# EasyEDA Pro project Version2.eprj

# Schematic Design

## Sheets
1 inputs: Board Name: v2.0; Create Date: 2025-04-06; Page Name: inputs; Project Name: KVM Assistant 3; Schematic Name: Design; Update Date: 2025-04-19; Company: EasyEDA.com; Page Size: A4; Version: V1.0
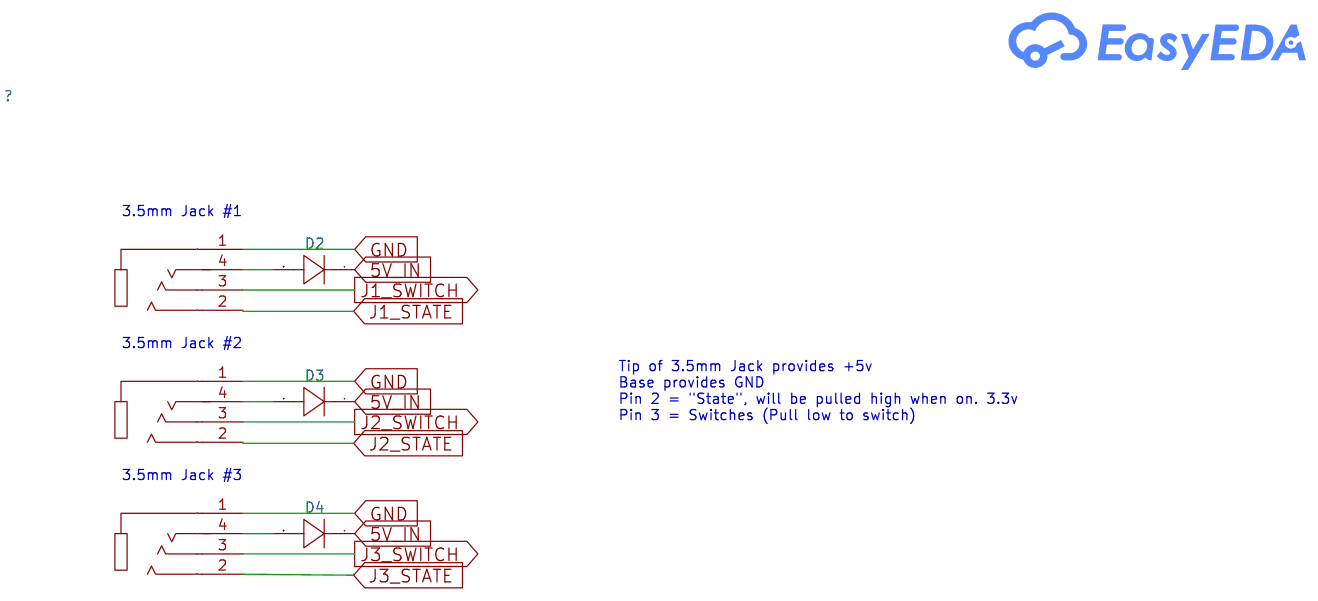
[diagram p0: inputs]
2 logic: Page Name: logic
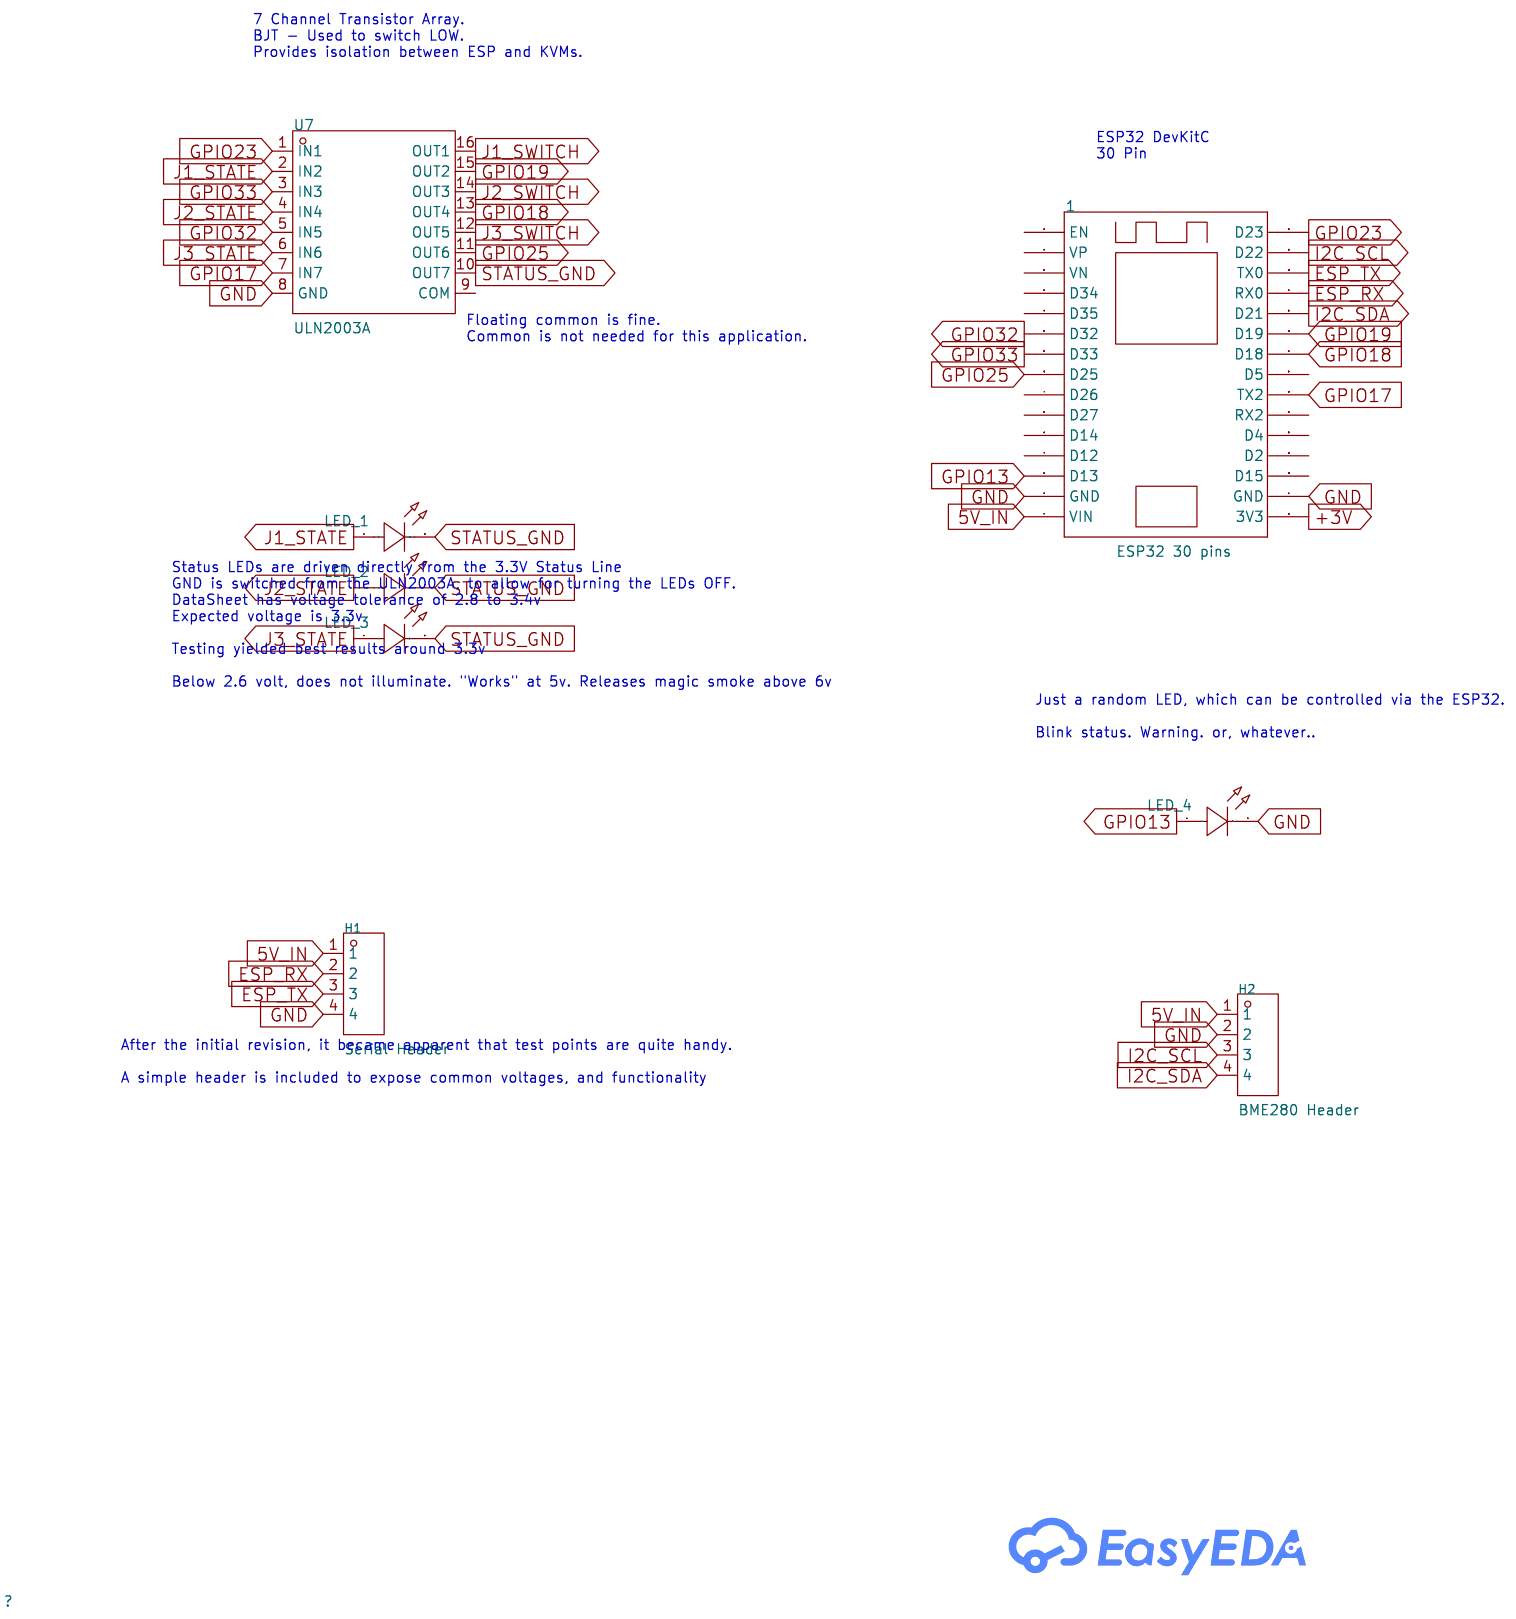
[diagram p1: logic]

## Parts
sheet inputs
3.5mm1  PJ-320D  [AUDIO-SMD_PJ-320D]
3.5mm2  PJ-320D  [AUDIO-SMD_PJ-320D]
3.5mm3  PJ-320D  [AUDIO-SMD_PJ-320D]
D2  -  [DO-41_BD2.4-L4.7-P8.70-D0.9-RD]
D3  -  [DO-41_BD2.4-L4.7-P8.70-D0.9-RD]
D4  -  [DO-41_BD2.4-L4.7-P8.70-D0.9-RD]
sheet logic
1  ESP32 30 pins  [ESP32 DEVKIT 30 PINS]
H1  Serial Header  [HDR-TH_4P-P2.54-V-M]
H2  BME280 Header  [HDR-TH_4P-P2.54-V-M]
LED_1  DY-332SUGD-A3  [LED-TH_BD5.9-P2.54-FD]
LED_2  DY-332SUGD-A3  [LED-TH_BD5.9-P2.54-FD]
LED_3  DY-332SUGD-A3  [LED-TH_BD5.9-P2.54-FD]
LED_4  DY-332SUGD-A3  [LED-TH_BD5.9-P2.54-FD]
U7  ULN2003A  [DIP-16_L20.0-W6.4-P2.54-LS7.6-BL]

## Library data of the parts
3.5mm1-3.5mm3 = PJ-320D_C431535: Connector Type:3.5mm Headphone Jack Current Rating (Max):500mA Voltage Rating (Max):50V Contact Material:Copper Contact Plating:Silver Operating Temperature Range:-30℃~+70℃ Operating Temperature Range:-30℃~+70℃; LCSC Part Name: 3.5mm耳机座; Supplier Part: C431535; Manufacturer: SHOU HAN(首韩); Supplier Footprint: SMD; JLCPCB Part Class: Extended Part; Datasheet: https://atta.szlcsc.com/upload/public/pdf/source/20190925/C431535_8B274506621F6117FB020BF07A197848.pdf; Supplier: LCSC; Connector Type: 3.5mm Headphone Jack; Current Rating (Max): 500mA; Voltage Rating (Max): 50V; Contact Material: Copper; Contact Plating: Silver; Operating Temperature Range: -30℃~+70℃; INPUT_NUMBER: 1
D2-D4 = 1N4007: Supplier Footprint: DO-41; INPUT_NUMBER: 1
1 = ESP32 30 pins
H1 H2 = PZ254V-11-04P: LCSC Part Name: 间距:2.54mm 1x4P 直插 方针; Supplier Part: C2691448; Manufacturer: XFCN(兴飞); Supplier Footprint: 插件,P=2.54mm; JLCPCB Part Class: Extended Part; Datasheet: https://atta.szlcsc.com/upload/public/pdf/source/20200309/C492403_F9F19131791D08044AD4F84F8E751A34.pdf; Supplier: LCSC; Pin Structure: 1x4P; Pitch: 2.54mm; Circluar Pins/Square Pins: Square Pins; Mounting Type: Straight; Number of Rows: Plugin; Number of Pins: 4P; Current Rating (Max): 3A; Voltage Rating (Max): 250V; Length of Mating Pin: 6mm; Insulation Height: 2.5mm; Length of End Connection Pin: 3mm; Operating Temperature Range: -40℃~+105℃; Color: Black
LED_1-LED_4 = DY-332SUGD-A3: LCSC Part Name: 5mm圆头有边翠绿色; Supplier Part: C7470788; Manufacturer: TONYU(东裕); Supplier Footprint: D=5mm; JLCPCB Part Class: Extended Part; Datasheet: https://atta.szlcsc.com/upload/public/pdf/source/20230726/AA93B767F39ACAA896428125483B3D95.pdf; Supplier: LCSC
U7 = ULN2003A_C93000: Supplier Part: C93000; Manufacturer: ST(意法半导体); Supplier Footprint: DIP-16; JLCPCB Part Class: Extended Part; Datasheet: https://atta.szlcsc.com/upload/public/pdf/source/20171116/C93000_15108227945891124497.pdf; Supplier: LCSC

## Nets
5V_IN: 1.1(VIN) D2.1(K) D3.1(K) D4.1(K) H1.1 H2.1
+3V: 1.16(3V3)
GND: 1.2(GND) 1.17(GND) 3.5mm1.1 3.5mm2.1 3.5mm3.1 H1.4 H2.2 LED_4.2(C) U7.8(GND)
ESP_RX: 1.27(RX0) H1.2
ESP_TX: 1.28(TX0) H1.3
GPIO13: 1.3(D13) LED_4.1(A)
GPIO17: 1.22(TX2) U7.7(IN7)
GPIO18: 1.24(D18) U7.13(OUT4)
GPIO19: 1.25(D19) U7.15(OUT2)
GPIO23: 1.30(D23) U7.1(IN1)
GPIO25: 1.8(D25) U7.11(OUT6)
GPIO32: 1.10(D32) U7.5(IN5)
GPIO33: 1.9(D33) U7.3(IN3)
I2C_SCL: 1.29(D22) H2.3
I2C_SDA: 1.26(D21) H2.4
J1_STATE: 3.5mm1.2 LED_1.1(A) U7.2(IN2)
J1_SWITCH: 3.5mm1.3 U7.16(OUT1)
J2_STATE: 3.5mm2.2 LED_2.1(A) U7.4(IN4)
J2_SWITCH: 3.5mm2.3 U7.14(OUT3)
J3_STATE: 3.5mm3.2 LED_3.1(A) U7.6(IN6)
J3_SWITCH: 3.5mm3.3 U7.12(OUT5)
STATUS_GND: LED_1.2(C) LED_2.2(C) LED_3.2(C) U7.10(OUT7)
$1N2388: 3.5mm1.4 D2.2(A)
$1N2516: 3.5mm2.4 D3.2(A)
$1N2644: 3.5mm3.4 D4.2(A)

Not connected (* = marked no-connect by the designer): 1 4(D12) 5(D14) 6(D27) 7(D26) 11(D35) 12(D34) 13(VN) 14(VP) 15(EN) 18(D15) 19(D2) 20(D4) 21(RX2) 23(D5); U7 9(COM)

## Notes on the sheets
sheet 1
- 3.5mm Jack #1
- 3.5mm Jack #2
- Tip of 3.5mm Jack provides +5v
  Base provides GND
  Pin 2 = "State", will be pulled high when on. 3.3v
  Pin 3 = Switches (Pull low to switch)
- 3.5mm Jack #3
sheet 2
- 7 Channel Transistor Array.
  BJT - Used to switch LOW.
  Provides isolation between ESP and KVMs.
- ESP32 DevKitC
  30 Pin
- Floating common is fine.
  Common is not needed for this application.
- Status LEDs are driven directly from the 3.3V Status Line
  GND is switched from the ULN2003A, to allow for turning the LEDs OFF.
  DataSheet has voltage tolerance of 2.8 to 3.4v
  Expected voltage is 3.3v
  Testing yielded best results around 3.3v
  Below 2.6 volt, does not illuminate. "Works" at 5v. Releases magic smoke above 6v
- Just a random LED, which can be controlled via the ESP32.
  Blink status. Warning. or, whatever..
- After the initial revision, it became apparent that test points are quite handy.
  A simple header is included to expose common voltages, and functionality
